# Altium schematic sheet NB-IoT_Module.SchDoc
size A
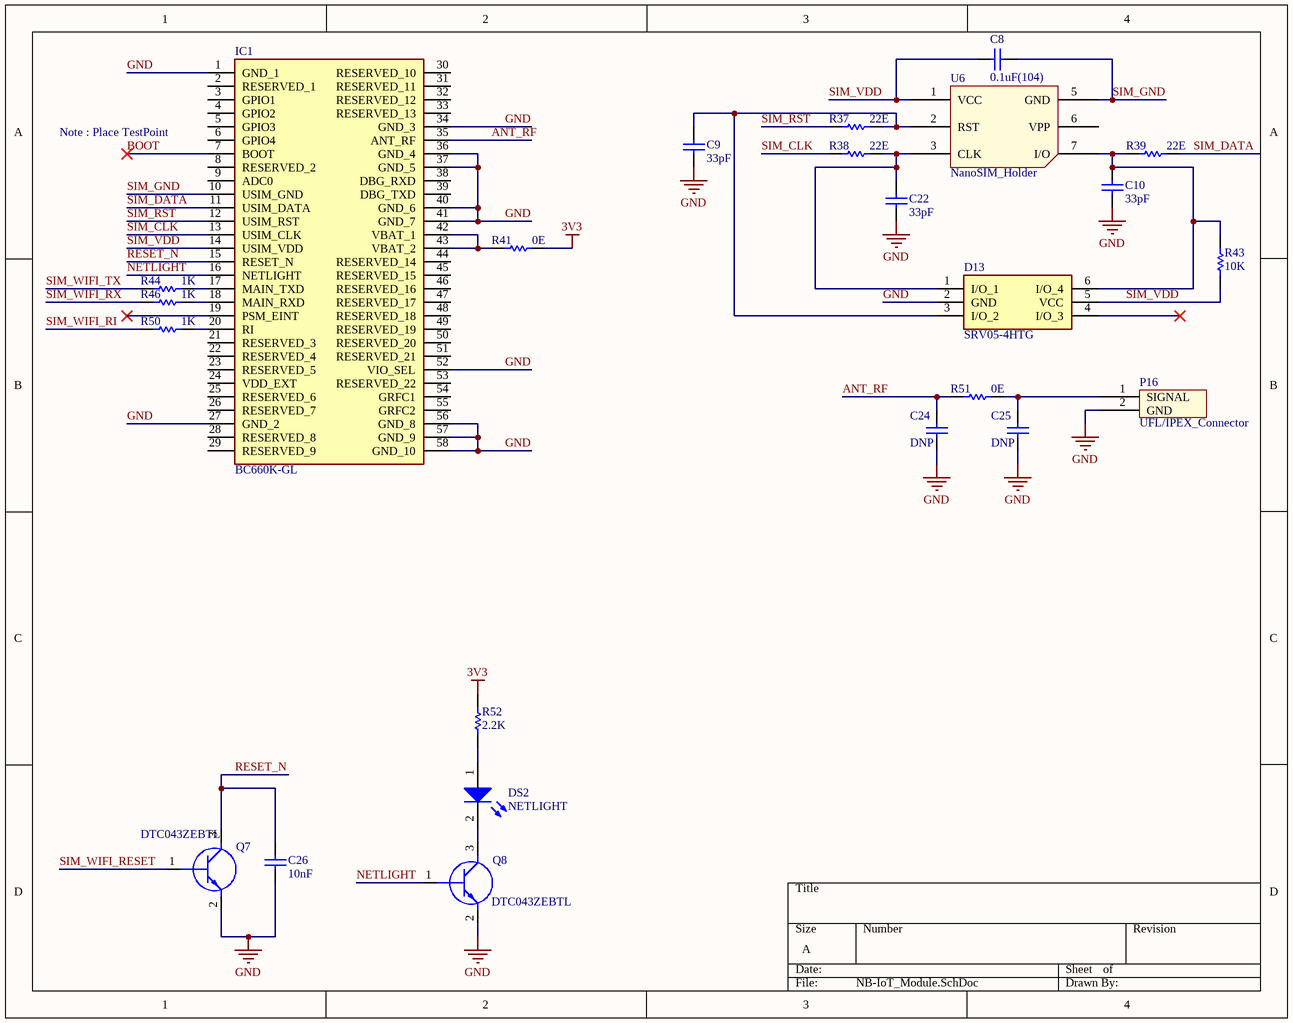
[diagram p0: NB-IoT_Module.SchDoc]

## Parts
C8  value 0.1uF(104)  [0805]  (hidden comment: Cap)
C9  value 33pF  [0805]  (hidden comment: Cap)
C10  value 33pF  [0805]  (hidden comment: Cap)
C22  value 33pF  [0805]  (hidden comment: Cap)
C24  value DNP  [0805]  (hidden comment: Cap)
C25  value DNP  [0805]  (hidden comment: Cap)
C26  value 10nF  [0805]  (hidden comment: Cap)
D13  SRV05-4HTG  [SOT95P280X145-6N]
DS2  NETLIGHT  [0805_LED]
IC1  BC660K-GL  [BC660KGL]
P16  UFL/IPEX_Connector  [RFAnt_Connector]
Q7  DTC043ZEBTL  [SOTFL50P160X85-3N]
Q8  DTC043ZEBTL  [SOTFL50P160X85-3N]
R37  value 22E  [0805]  (hidden comment: Res1)
R38  value 22E  [0805]  (hidden comment: Res1)
R39  value 22E  [0805]  (hidden comment: Res1)
R41  value 0E  [0805]  (hidden comment: Res1)
R43  value 10K  [0805]  (hidden comment: Res1)
R44  value 1K  [0805]  (hidden comment: Res1)
R46  value 1K  [0805]  (hidden comment: Res1)
R50  value 1K  [0805]  (hidden comment: Res1)
R51  value 0E  [0805]  (hidden comment: Res1)
R52  value 2.2K  [0805]  (hidden comment: Res1)
U6  NanoSIM_Holder  [Nano_SIMCard_Holder]

## Nets
3V3: R41.1 R52.2
GND: C9.1 C10.1 C22.1 C24.2 C25.2 C26.2 D13.2(GND) IC1.1(GND_1) IC1.27(GND_2) IC1.34(GND_3) IC1.36(GND_4) IC1.37(GND_5) IC1.40(GND_6) IC1.41(GND_7) IC1.52(VIO_SEL) IC1.56(GND_8) IC1.57(GND_9) IC1.58(GND_10) P16.2(GND) Q7.2(E) Q8.2(E)
ANT_RF: C24.1 IC1.35(ANT_RF) R51.2
BOOT: IC1.7(BOOT)
NETLIGHT: IC1.16(NETLIGHT) Q8.1(B)
RESET_N: C26.1 IC1.15(RESET_N) Q7.3(C)
SIM_CLK: IC1.13(USIM_CLK) R38.2
SIM_DATA: IC1.11(USIM_DATA) R39.1
SIM_GND: C8.1 IC1.10(USIM_GND) U6.5(GND)
SIM_RST: IC1.12(USIM_RST) R37.2
SIM_VDD: C8.2 D13.5(VCC) IC1.14(USIM_VDD) R43.2 U6.1(VCC)
SIM_WIFI_RESET: Q7.1(B)
SIM_WIFI_RI: R50.2
SIM_WIFI_RX: R46.2
SIM_WIFI_TX: R44.2
NetC9_2: C9.2 D13.3(I/O_2) R37.1 U6.2(RST)
NetC10_2: C10.2 D13.6(I/O_4) R39.2 R43.1 U6.7(I/O)
NetC22_2: C22.2 D13.1(I/O_1) R38.1 U6.3(CLK)
NetC25_1: C25.1 P16.1(SIGNAL) R51.1
NetDS2_1: DS2.1(A) R52.1
NetDS2_2: DS2.2(K) Q8.3(C)
NetIC1_17: IC1.17(MAIN_TXD) R44.1
NetIC1_18: IC1.18(MAIN_RXD) R46.1
NetIC1_20: IC1.20(RI) R50.1
NetIC1_42: IC1.42(VBAT_1) IC1.43(VBAT_2) R41.2

Not connected (* = marked no-connect by the designer): D13 4(I/O_3)*; IC1 2(RESERVED_1) 3(GPIO1) 4(GPIO2) 5(GPIO3) 6(GPIO4) 8(RESERVED_2) 9(ADC0) 19(PSM_EINT)* 21(RESERVED_3) 22(RESERVED_4) 23(RESERVED_5) 24(VDD_EXT) 25(RESERVED_6) 26(RESERVED_7) 28(RESERVED_8) 29(RESERVED_9) 30(RESERVED_10) 31(RESERVED_11) 32(RESERVED_12) 33(RESERVED_13) 38(DBG_RXD) 39(DBG_TXD) 44(RESERVED_14) 45(RESERVED_15) 46(RESERVED_16) 47(RESERVED_17) 48(RESERVED_18) 49(RESERVED_19) 50(RESERVED_20) 51(RESERVED_21) 53(RESERVED_22) 54(GRFC1) 55(GRFC2); U6 6(VPP)

## Notes on the sheet
- (near IC1) Note : Place TestPoint

## Library data of the parts
C8-C10 C22 C24-C26 = Cap: Capacitor; Published: 8-Jun-2000; LatestRevisionDate: 17-Jul-2002; LatestRevisionNote: Re-released for DXP Platform.; PackageReference: RAD-0.3; Publisher: Altium Limited; PackageDescription: Radial Cap, Thru-Hole; 2 Leads; 0.3 in Pin Spacing
D13 = SRV05-4HTG: TVS Diode (Uni-directional); Manufacturer_Name: LITTELFUSE; Datasheet Link: https://componentsearchengine.com/Datasheets/2/SRV05-4HTG.pdf; Height: 1.45mm; Manufacturer_Part_Number: SRV05-4HTG; Mouser Part Number: 576-SRV05-4HTG; Mouser Price/Stock: https://www.mouser.co.uk/ProductDetail/Littelfuse/SRV05-4HTG?qs=TI15CVqcli3Liexbf3C%2FVA%3D%3D; Arrow Part Number: SRV05-4HTG; Arrow Price/Stock: https://www.arrow.com/en/products/srv05-4htg/littelfuse?region=europe
DS2 = LED0: LED 5mm Diameter; Published: 8-Jun-2000; LatestRevisionDate: 08-Jul-2005; LatestRevisionNote: Mech Layer 1 removed.; PackageReference: LED-0; Publisher: Altium Limited; PackageDescription: LED; 2 Leads
IC1 = BC660K-GL: Integrated Circuit; Manufacturer_Name: Quectel; Datasheet Link: https://www.quectel.com/wp-content/uploads/2021/04/Quectel_BC660K-GL_Hardware_Design_V1.0.pdf; Height: 2.2mm; Manufacturer_Part_Number: BC660K-GL
P16 = UFL_Connector
Q7 Q8 = DTC043ZEBTL: Transistor BJT NPN; Manufacturer_Name: ROHM Semiconductor; Datasheet Link: http://rohmfs.rohm.com/en/products/databook/datasheet/discrete/transistor/digital/dtc043zmt2l-e.pdf; Height: 0.85mm; Manufacturer_Part_Number: DTC043ZEBTL; Mouser Part Number: 755-DTC043ZEBTL; Mouser Price/Stock: https://www.mouser.co.uk/ProductDetail/ROHM-Semiconductor/DTC043ZEBTL?qs=n7vHx8wJlDGyWrBOh0icRQ%3D%3D
R37-R39 R41 R43 R44 R46 R50-R52 = Res1: Resistor; Published: 8-Jun-2000; LatestRevisionDate: 17-Jul-2002; LatestRevisionNote: Re-released for DXP Platform.; PackageReference: AXIAL-0.3; Publisher: Altium Limited; PackageDescription: Axial Device, Thru-Hole; 2 Leads; 0.3 in Pin Spacing